# Altium schematic sheet digipot.SchDoc
size A
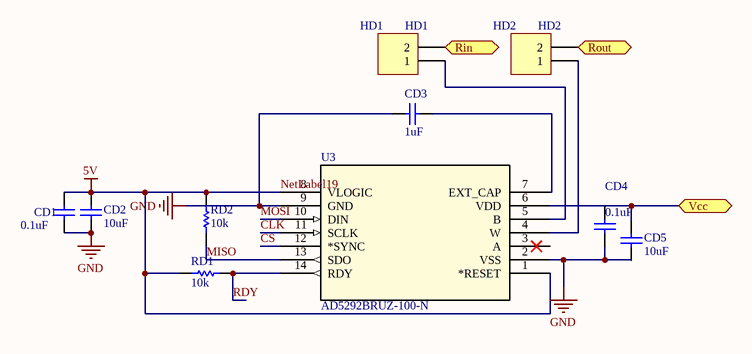
[diagram p0: digipot.SchDoc]

## Parts
CD1  value 0.1uF  [CC2012-0805]  (hidden comment: Cap-NP)
CD2  value 10uF  [CC2012-0805]  (hidden comment: Cap-NP)
CD3  value 1uF  [CC2012-0805]  (hidden comment: Cap-NP)
CD4  value 0.1uF  [CC2012-0805]  (hidden comment: Cap-NP)
CD5  value 10uF  [CC2012-0805]  (hidden comment: Cap-NP)
HD1  HD1  [HDR1X2]
HD2  HD2  [HDR1X2]
RD1  value 10k  [CC2012-0805]  (hidden comment: Res)
RD2  value 10k  [CC2012-0805]  (hidden comment: Res)
U3  AD5292BRUZ-100-N  [RU_14]

## Ports
Rin, Rout, Vcc

## Nets
GND: CD1.2 CD2.2 CD3.1 CD4.1 CD5.1 U3.2(VSS) U3.9(GND)
NetLabel19: CD1.1 CD2.1 RD1.2 RD2.1 U3.1(*RESET) U3.8(VLOGIC)  [also labelled 5V]
CLK: U3.11(SCLK)
CS: U3.12(*SYNC)
MISO: RD2.2 U3.13(SDO)
MOSI: U3.10(DIN)
RDY: RD1.1 U3.14(RDY)
Rin: HD1.2 ; port Rin
Rout: HD2.2 ; port Rout
Vcc: CD4.2 CD5.2 U3.6(VDD) ; port Vcc
NetCD3_2: CD3.2 U3.7(EXT_CAP)
NetHD1_1: HD1.1 U3.5(B)
NetHD2_1: HD2.1 U3.4(W)

Not connected (* = marked no-connect by the designer): U3 3(A)

## Library data of the parts
CD1-CD5 = Cap-NP: Capacitor; Manufacturer: Generic Components; Class I: Passive; Published: 8-Jun-2000; Revision: July-2002: Re-released for DXP Platform.; Publisher: Altium Limited; Class II: Capacitor
HD1 HD2 = Header 2: Header, 2-Pin; LatestRevisionDate: 17-Jul-2002; LatestRevisionNote: Re-released for DXP Platform.; Publisher: Altium Limited
RD1 RD2 = Res: Resistor; Manufacturer: Generic Components; Class I: Passive; Published: 8-Jun-2000; Revision: July-2002: Re-released for DXP Platform.; Publisher: Altium Limited; Class II: Resistor
U3 = AD5292BRUZ-100-N: Imported; Manufacturer_Part_Number: AD5292BRUZ-100-ND; Vendor: Analog Devices Inc; Built_By: EMA_UL_Team; RefDes: RefDes; Type: DEV; Value: Value